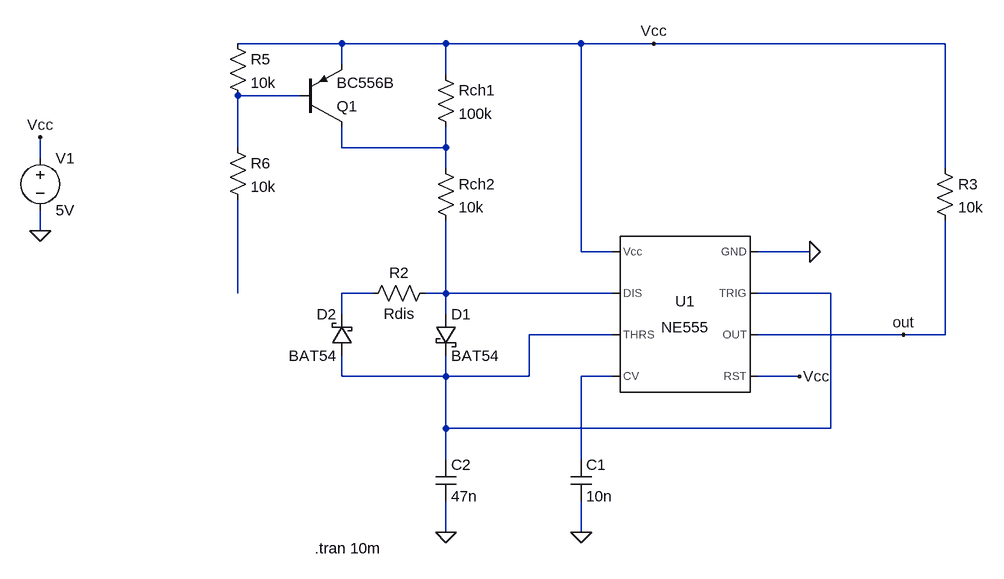
[diagram p0: schematic 555-PWM.asc]
555-PWM.asc, the LTspice schematic file:
Version 4
SHEET 1 880 680
WIRE -400 -448 -560 -448
WIRE -240 -448 -400 -448
WIRE -32 -448 -240 -448
WIRE 80 -448 -32 -448
WIRE 528 -448 80 -448
WIRE -400 -416 -400 -448
WIRE -240 -400 -240 -448
WIRE -464 -368 -560 -368
WIRE -560 -288 -560 -368
WIRE -400 -288 -400 -320
WIRE -240 -288 -240 -320
WIRE -240 -288 -400 -288
WIRE -864 -272 -864 -304
WIRE -240 -256 -240 -288
WIRE 528 -256 528 -448
WIRE -864 -160 -864 -192
WIRE -32 -128 -32 -448
WIRE 16 -128 -32 -128
WIRE 320 -128 240 -128
WIRE -560 -64 -560 -208
WIRE -352 -64 -400 -64
WIRE -240 -64 -240 -176
WIRE -240 -64 -272 -64
WIRE 16 -64 -240 -64
WIRE 352 -64 240 -64
WIRE -400 -32 -400 -64
WIRE -240 -32 -240 -64
WIRE 16 0 -112 0
WIRE 464 0 240 0
WIRE 528 0 528 -176
WIRE 528 0 464 0
WIRE -400 64 -400 32
WIRE -240 64 -240 32
WIRE -240 64 -400 64
WIRE -112 64 -112 0
WIRE -112 64 -240 64
WIRE 16 64 -32 64
WIRE 304 64 240 64
WIRE -240 144 -240 64
WIRE 352 144 352 -64
WIRE 352 144 -240 144
WIRE -240 192 -240 144
WIRE -32 192 -32 64
WIRE -240 304 -240 256
WIRE -32 304 -32 256
FLAG -864 -160 0
FLAG -864 -304 Vcc
FLAG 304 64 Vcc
FLAG -32 304 0
FLAG -240 304 0
FLAG 320 -128 0
FLAG 464 0 out
FLAG 80 -448 Vcc
SYMBOL Misc\\NE555 128 -32 M0
SYMATTR InstName U1
SYMBOL voltage -864 -288 R0
WINDOW 123 0 0 Left 0
WINDOW 39 0 0 Left 0
SYMATTR InstName V1
SYMATTR Value 5V
SYMBOL cap -48 192 R0
SYMATTR InstName C1
SYMATTR Value 10n
SYMBOL cap -256 192 R0
SYMATTR InstName C2
SYMATTR Value 47n
SYMBOL schottky -256 -32 R0
SYMATTR InstName D1
SYMATTR Value BAT54
SYMATTR Description Diode
SYMATTR Type diode
SYMBOL schottky -384 32 R180
WINDOW 0 24 64 Left 2
WINDOW 3 24 0 Left 2
SYMATTR InstName D2
SYMATTR Value BAT54
SYMATTR Description Diode
SYMATTR Type diode
SYMBOL res -256 -272 R0
SYMATTR InstName Rch2
SYMATTR Value 10k
SYMBOL res -256 -80 R90
WINDOW 0 0 56 VBottom 2
WINDOW 3 32 56 VTop 2
SYMATTR InstName R2
SYMATTR Value Rdis
SYMBOL res 512 -272 R0
SYMATTR InstName R3
SYMATTR Value 10k
SYMBOL res -256 -416 R0
SYMATTR InstName Rch1
SYMATTR Value 100k
SYMBOL pnp -464 -320 M180
SYMATTR InstName Q1
SYMATTR Value BC556B
SYMBOL res -576 -464 R0
SYMATTR InstName R5
SYMATTR Value 10k
SYMBOL res -576 -304 R0
SYMATTR InstName R6
SYMATTR Value 10k
TEXT -442 328 Left 2 !.tran 10m

The netlist it stands for:
* 555-PWM.asc
XU1 0 N006 out Vcc N007 N006 N005 Vcc NE555  ; pins GND TRIG OUT RST CV THRS DIS Vcc
V1 Vcc 0 5V
C1 N007 0 10n
C2 N006 0 47n
D1 N005 N006 BAT54
D2 N006 N004 BAT54
Rch2 N002 N005 10k
R2 N005 N004 Rdis
R3 Vcc out 10k
Rch1 Vcc N002 100k
Q1 N002 N001 Vcc 0 BC556B
R5 Vcc N001 10k
R6 N001 N003 10k
.model D D
.lib standard.dio
.model NPN NPN
.model PNP PNP
.lib standard.bjt
.tran 10m
.lib NE555.sub
.backanno
.end